# Altium schematic sheet rf.SchDoc: RF
size Letter; CheckedBy: J. Brinton; CompanyName: Signal Laboratories, Inc.; DrawnBy: J. Brinton; Engineer: J. Brinton; Address1: 3479 Edison Way; Address2: Menlo Park CA 94025; Address3: +1 (877) 778-8435; Address4: siglabs.com; Revision: 3; SheetNumber: 3; SheetTotal: 49
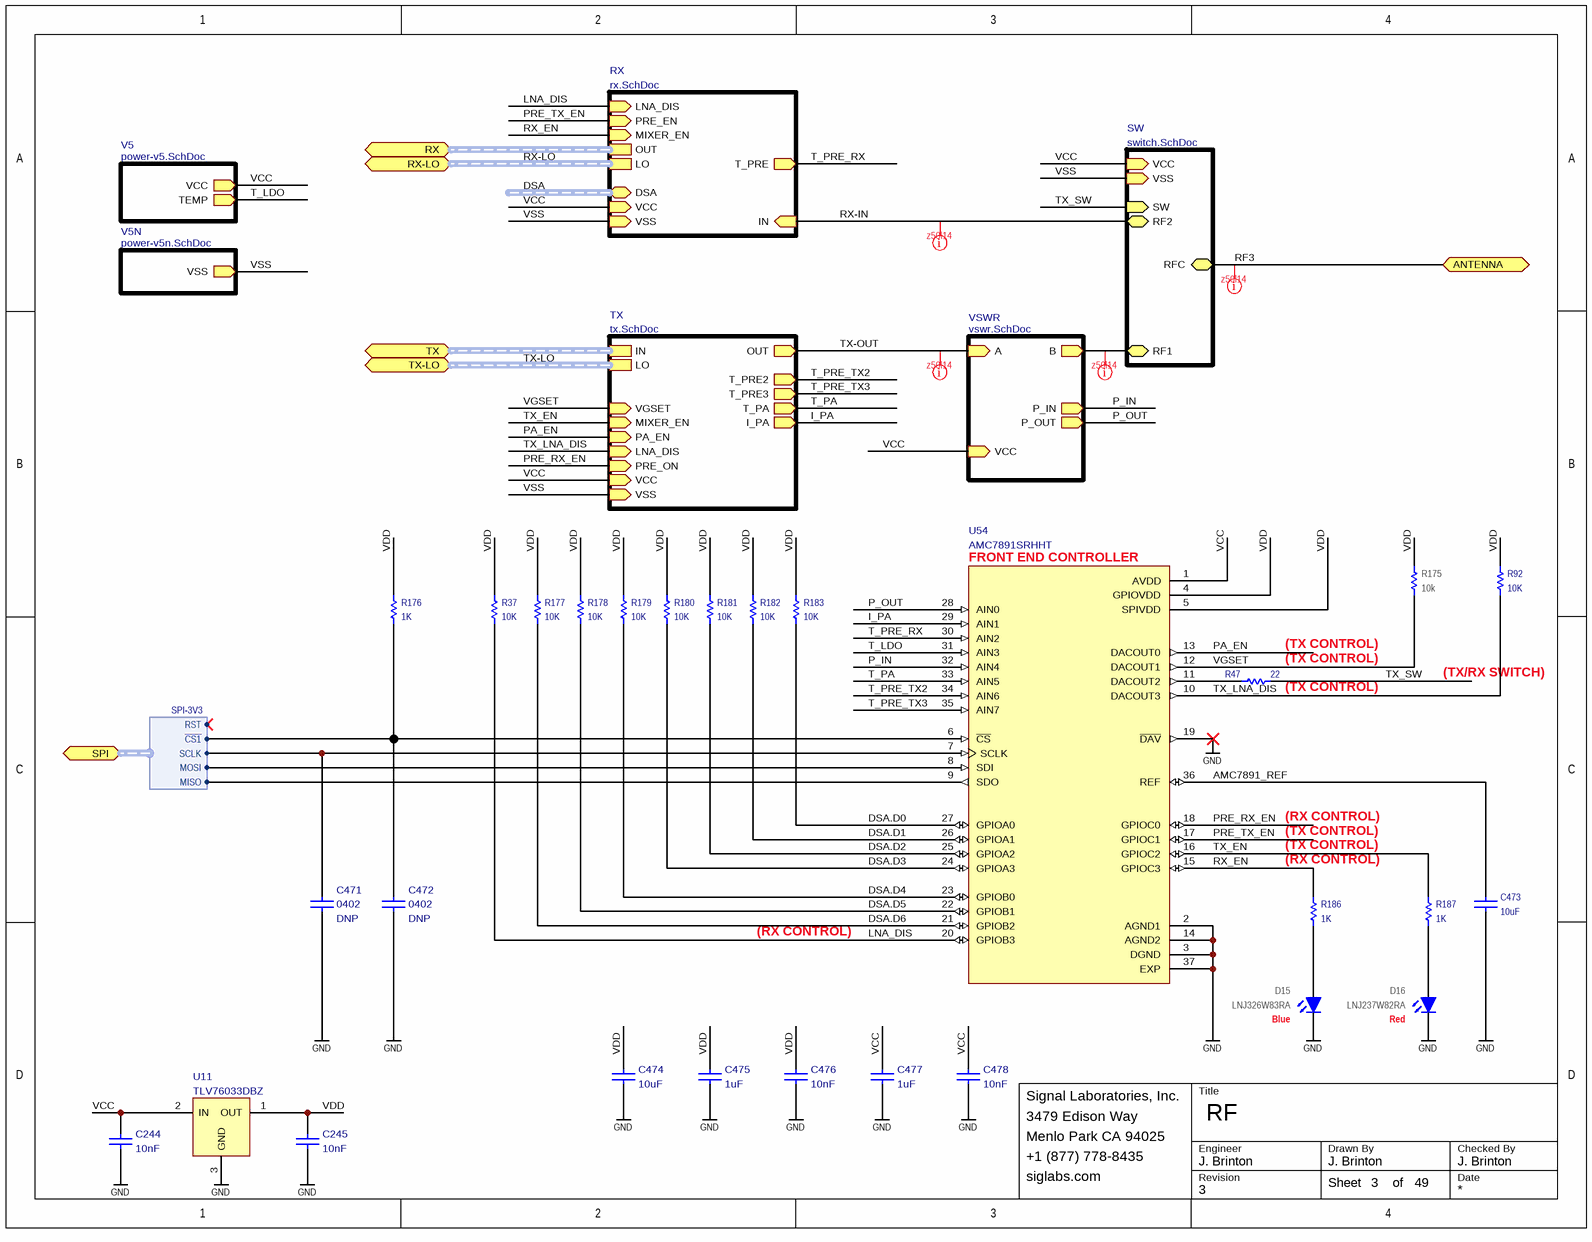
[diagram p0: rf.SchDoc]

## Parts
C244  value 10nF  [CAPC100X50X55L25N]  (hidden comment: GRM155R71H103KA88)
C245  value 10nF  [CAPC100X50X55L25N]  (hidden comment: GRM155R71H103KA88)
C471  Package: 0402  Do Not Place: DNP  [CAPC100X50X55L25N]  (hidden comment: VJ0402A101KXA)
C472  Package: 0402  Do Not Place: DNP  [CAPC100X50X55L25N]  (hidden comment: VJ0402A101KXA)
C473  value 10uF  [CAPC160X80X90L20N]  (hidden comment: ZRB18AR61E106ME01L)
C474  value 10uF  [CAPC200X125X145L45N]  (hidden comment: CL21B106KOQNNNE)
C475  value 1uF  [CAPC200X125X145L45N]  (hidden comment: TMK212B7105KG)
C476  value 10nF  [CAPC100X50X55L25N]  (hidden comment: GRM155R71H103KA88)
C477  value 1uF  [CAPC200X125X145L45N]  (hidden comment: TMK212B7105KG)
C478  value 10nF  [CAPC100X50X55L25N]  (hidden comment: GRM155R71H103KA88)
D15  LNJ326W83RA  [0603_LED]
D16  LNJ237W82RA  [0603_LED]
R37  value 10K  [RESC1005X40N]  (hidden comment: ERJ-2RKF1002X)
R47  value 22  [RESC1005X40N]  (hidden comment: RC0402FR-0722RL)
R92  value 10K  [RESC1005X40N]  (hidden comment: ERJ-2RKF1002X)
R175  value 10k  [RESC1005X40N]  (hidden comment: ERJ-2RKF1002X)
R176  value 1K  [RESC1005X40N]  (hidden comment: RC0402FR-071KL)
R177  value 10K  [RESC1005X40N]  (hidden comment: ERJ-2RKF1002X)
R178  value 10K  [RESC1005X40N]  (hidden comment: ERJ-2RKF1002X)
R179  value 10K  [RESC1005X40N]  (hidden comment: ERJ-2RKF1002X)
R180  value 10K  [RESC1005X40N]  (hidden comment: ERJ-2RKF1002X)
R181  value 10K  [RESC1005X40N]  (hidden comment: ERJ-2RKF1002X)
R182  value 10K  [RESC1005X40N]  (hidden comment: ERJ-2RKF1002X)
R183  value 10K  [RESC1005X40N]  (hidden comment: ERJ-2RKF1002X)
R186  value 1K  [RESC1005X40N]  (hidden comment: RC0402FR-071KL)
R187  value 1K  [RESC1005X40N]  (hidden comment: RC0402FR-071KL)
U11  TLV76033DBZ  [SOT23]
U54  AMC7891SRHHT  [QFN50P600X600X90-37N]

## Sub-sheets
RX = rx.SchDoc: IN (in), OUT (harness DIFF100), LO (harness CLK-LVPECL33-TERM), DSA (harness DSA), MIXER_EN (in), LNA_DIS (in), VCC (in), VSS (in), PRE_EN (in), T_PRE (out)
SW = switch.SchDoc: SW (in), RFC (bidir), RF1 (bidir), RF2 (bidir), VCC (in), VSS (in)
TX = tx.SchDoc: LO (harness CLK-LVDS), OUT (out), IN (harness DIFF100), VGSET (in), T_PA (out), MIXER_EN (in), PA_EN (in), T_PRE2 (out), VCC (in), VSS (in), PRE_ON (in), I_PA (out), T_PRE3 (out), LNA_DIS (in)
V5 = power-v5.SchDoc: VCC (out), TEMP (out)
V5N = power-v5n.SchDoc: VSS (out)
VSWR = vswr.SchDoc: B (out), A (in), P_IN (out), P_OUT (out), VCC (in)

## Ports
ANTENNA (bidir), RX (harness DIFF100), RX-LO (harness CLK-LVPECL33-TERM), SPI (harness SPI-3V3), TX (harness DIFF100), TX-LO (harness CLK-LVDS)

## Harnesses
SPI-3V3: MOSI, MISO, SCLK, ~{CS1}, RST

## Nets
GND: C244.2 C245.2 C471.2 C472.2 C473.1 C474.2 C475.2 C476.2 C477.2 C478.2 D15.2(K) D16.2(K) U11.3(GND) U54.2(AGND1) U54.3(DGND) U54.14(AGND2) U54.19(~{DAV}) U54.37(EXP)
AMC7891_REF: C473.2 U54.36(REF)
DSA.D0: R183.2 U54.27(GPIOA0)
DSA.D1: R182.2 U54.26(GPIOA1)
DSA.D2: R181.2 U54.25(GPIOA2)
DSA.D3: R180.2 U54.24(GPIOA3)
DSA.D4: R179.2 U54.23(GPIOB0)
DSA.D5: R178.2 U54.22(GPIOB1)
DSA.D6: R177.2 U54.21(GPIOB2)
I_PA: U54.29(AIN1) ; sheet TX/I_PA
LNA_DIS: R37.2 U54.20(GPIOB3) ; sheet RX/LNA_DIS
P_IN: U54.32(AIN4) ; sheet VSWR/P_IN
P_OUT: U54.28(AIN0) ; sheet VSWR/P_OUT
PA_EN: U54.13(DACOUT0) ; sheet TX/PA_EN
PRE_RX_EN: U54.18(GPIOC0) ; sheet TX/PRE_ON
PRE_TX_EN: U54.17(GPIOC1) ; sheet RX/PRE_EN
RF3: port ANTENNA, sheet SW/RFC
RX-IN: sheet RX/IN, sheet SW/RF2
RX_EN: R186.2 U54.15(GPIOC3) ; sheet RX/MIXER_EN
T_LDO: U54.31(AIN3) ; sheet V5/TEMP
T_PA: U54.33(AIN5) ; sheet TX/T_PA
T_PRE_RX: U54.30(AIN2) ; sheet RX/T_PRE
T_PRE_TX2: U54.34(AIN6) ; sheet TX/T_PRE2
T_PRE_TX3: U54.35(AIN7) ; sheet TX/T_PRE3
TX-OUT: sheet TX/OUT, sheet VSWR/A
TX_EN: R187.2 U54.16(GPIOC2) ; sheet TX/MIXER_EN
TX_LNA_DIS: R92.2 U54.10(DACOUT3) ; sheet TX/LNA_DIS
TX_SW: R47.2 ; sheet SW/SW
VCC: C244.1 C477.1 C478.1 U11.2(IN) U54.1(AVDD) ; sheet RX/VCC, sheet TX/VCC, sheet SW/VCC, sheet V5/VCC, sheet VSWR/VCC
VDD: C245.1 C474.1 C475.1 C476.1 R37.1 R92.1 R175.1 R176.2 R177.1 R178.1 R179.1 R180.1 R181.1 R182.1 R183.1 U11.1(OUT) U54.4(GPIOVDD) U54.5(SPIVDD)
VGSET: R175.2 U54.12(DACOUT1) ; sheet TX/VGSET
VSS: sheet RX/VSS, sheet TX/VSS, sheet SW/VSS, sheet V5N/VSS
NetC471_1: C471.1 U54.7(SCLK) ; port SPI.SCLK
NetC472_1: C472.1 R176.1 U54.6(~{CS}) ; port SPI.~{CS1}
NetD15_1: D15.1(A) R186.1
NetD16_1: D16.1(A) R187.1
NetR47_1: R47.1 U54.11(DACOUT2)
NetU54_8: U54.8(SDI) ; port SPI.MOSI
NetU54_9: U54.9(SDO) ; port SPI.MISO
(unnamed): sheet SW/RF1, sheet VSWR/B

## Buses and harness runs
harness DSA = sheet RX/DSA
harness port RX = sheet RX/OUT
harness port TX = sheet TX/IN
harness RX-LO = port RX-LO = sheet RX/LO
harness TX-LO = port TX-LO = sheet TX/LO

## Layout directives
net class z50l14: (no net found under the mark), RF3, RX-IN, TX-OUT

## Notes on the sheet
- (near U54) FRONT END CONTROLLER
- (near R47) (TX CONTROL)
- (TX/RX SWITCH)
- (RX CONTROL)
- (near R186) (TX CONTROL)
- (TX CONTROL)
- (near R186) (RX CONTROL)
- (near D15) Blue
- (near D16) Red
- Title
- Engineer
- Revision
- Drawn By
- Checked By
- Date
- Sheet
- of

## Library data of the parts
C244 C245 C476 C478 = TMK105B7103KV: Ceramic Capacitor 10nF ±10% 50V X7R 0402; Manufacturer: Murata; Tr: -55:125; Manufacturer P/N: GRM155R71H103KA88; Tolerance: ±10%; Package: 0402; Voltage: 50V
C471 C472 = VJ0402A101JXA: Ceramic Capacitor 100pF ±10% 50V C0G 0402; Manufacturer: Vishay; Tr: -55:150; Manufacturer P/N: VJ0402A101KXA; Tolerance: ±10%; Value: 100pF; Voltage: 50V
C473 = CAP: Ceramic Capacitor 10uF ±20% 25V X5R 0603; Manufacturer: Murata; Tr: -55:85; Manufacturer P/N: ZRB18AR61E106ME01L; Tolerance: ±20%; Voltage: 25V; Footprint: *; Package: 0603
C474 = LMK212B7106KG: Ceramic Capacitor 10uF ±10% 16V X7R 0805; Manufacturer: Samsung; Tr: -55:105; Manufacturer P/N: CL21B106KOQNNNE; Tolerance: ±10%; Package: 0805; Voltage: 16V
C475 C477 = TMK212B7105KG: Ceramic Capacitor 1uF ±10% 25V X7R 0805; Manufacturer: Taiyo Yuden; Manufacturer P/N: TMK212B7105KG; Tolerance: ±10%; Tr: *; Package: 0805; Voltage: 25V
D15 = LED0603GR: LED, SMT 0603, Color Blue, 5mA, 2.9V; Manufacturer: Panasonic; Manufacturer P/N: LNJ937W8CRA; Package: 0603 Polarized
D16 = LED0603Y: LED, SMT 0603, Color Red, 10mA, 2.05V; Manufacturer: Panasonic; Manufacturer P/N: LNJ237W82RA; Package: 0603 Polarized
R37 R92 R177-R183 = RES 0402: Thick Film Resistor 10k ±1% 0.1W 50V 0402; Manufacturer: Panasonic; Tr: -55:155; Package: 0402; Manufacturer P/N: ERJ-2RKF1002X; Tolerance: ±1%
R47 = RES 0402: Thick Film Resistor 22 ±1% 0402; Manufacturer: Yageo; Tr: -55:155; Package: 0402; Manufacturer P/N: RC0402FR-0722RL; Do Not Place: *; Tolerance: ±1%
R175 = RES: Thick Film Resistor 10k ±1% 0.1W 50V 0402; Manufacturer: Panasonic; Tcr: ±100; Tr: -55:155; Voltage: 50; Power: 0.1; Manufacturer P/N: ERJ-2RKF1002X; Tolerance: ±1%; Alternatives: *; Footprint: *; Package: 0402
R176 R186 R187 = RES 0402: Thick Film Resistor 1k ±1% 0402; Manufacturer: Yageo; Tr: -55:155; Package: 0402; Manufacturer P/N: RC0402FR-071KL; Do Not Place: *; Tolerance: ±1%
U11 = TLV76033DBZ: 3.3V Fixed-Output LDO; Manufacturer: Texas Instruments; Manufacturer P/N: TLV76033DBZ
U54 = AMC7891SRHHT: Analog Monitoring & Control IC; Manufacturer: Texas Instruments; Manufacturer P/N: AMC7891SRHHT; Package: VQFN-36